# Altium schematic sheet PT1000_interface.SchDoc: RTD analog interface
size A3; Date: 30.05.2015; Author: Michał Gumiela; DocumentNumber: 5; SheetNumber: 5; SheetTotal: 9; Model: EM1; PageSetup: Record=PageOptions|CenterHorizontal=True|CenterVertical=True|PrintScale=0.52|XCorrection=1.00|YCorrection=1.00|PrintKind=1|BorderSize=5000000|LeftOffset=0|BottomOffset=0|Orientation=2|PaperLength=4200|PaperWidth=2970|Scale=100|PaperSource=7|PrintQuality=600|MediaType=1|DitherType=10|PaperKind=A3|PrintScaleMode=1
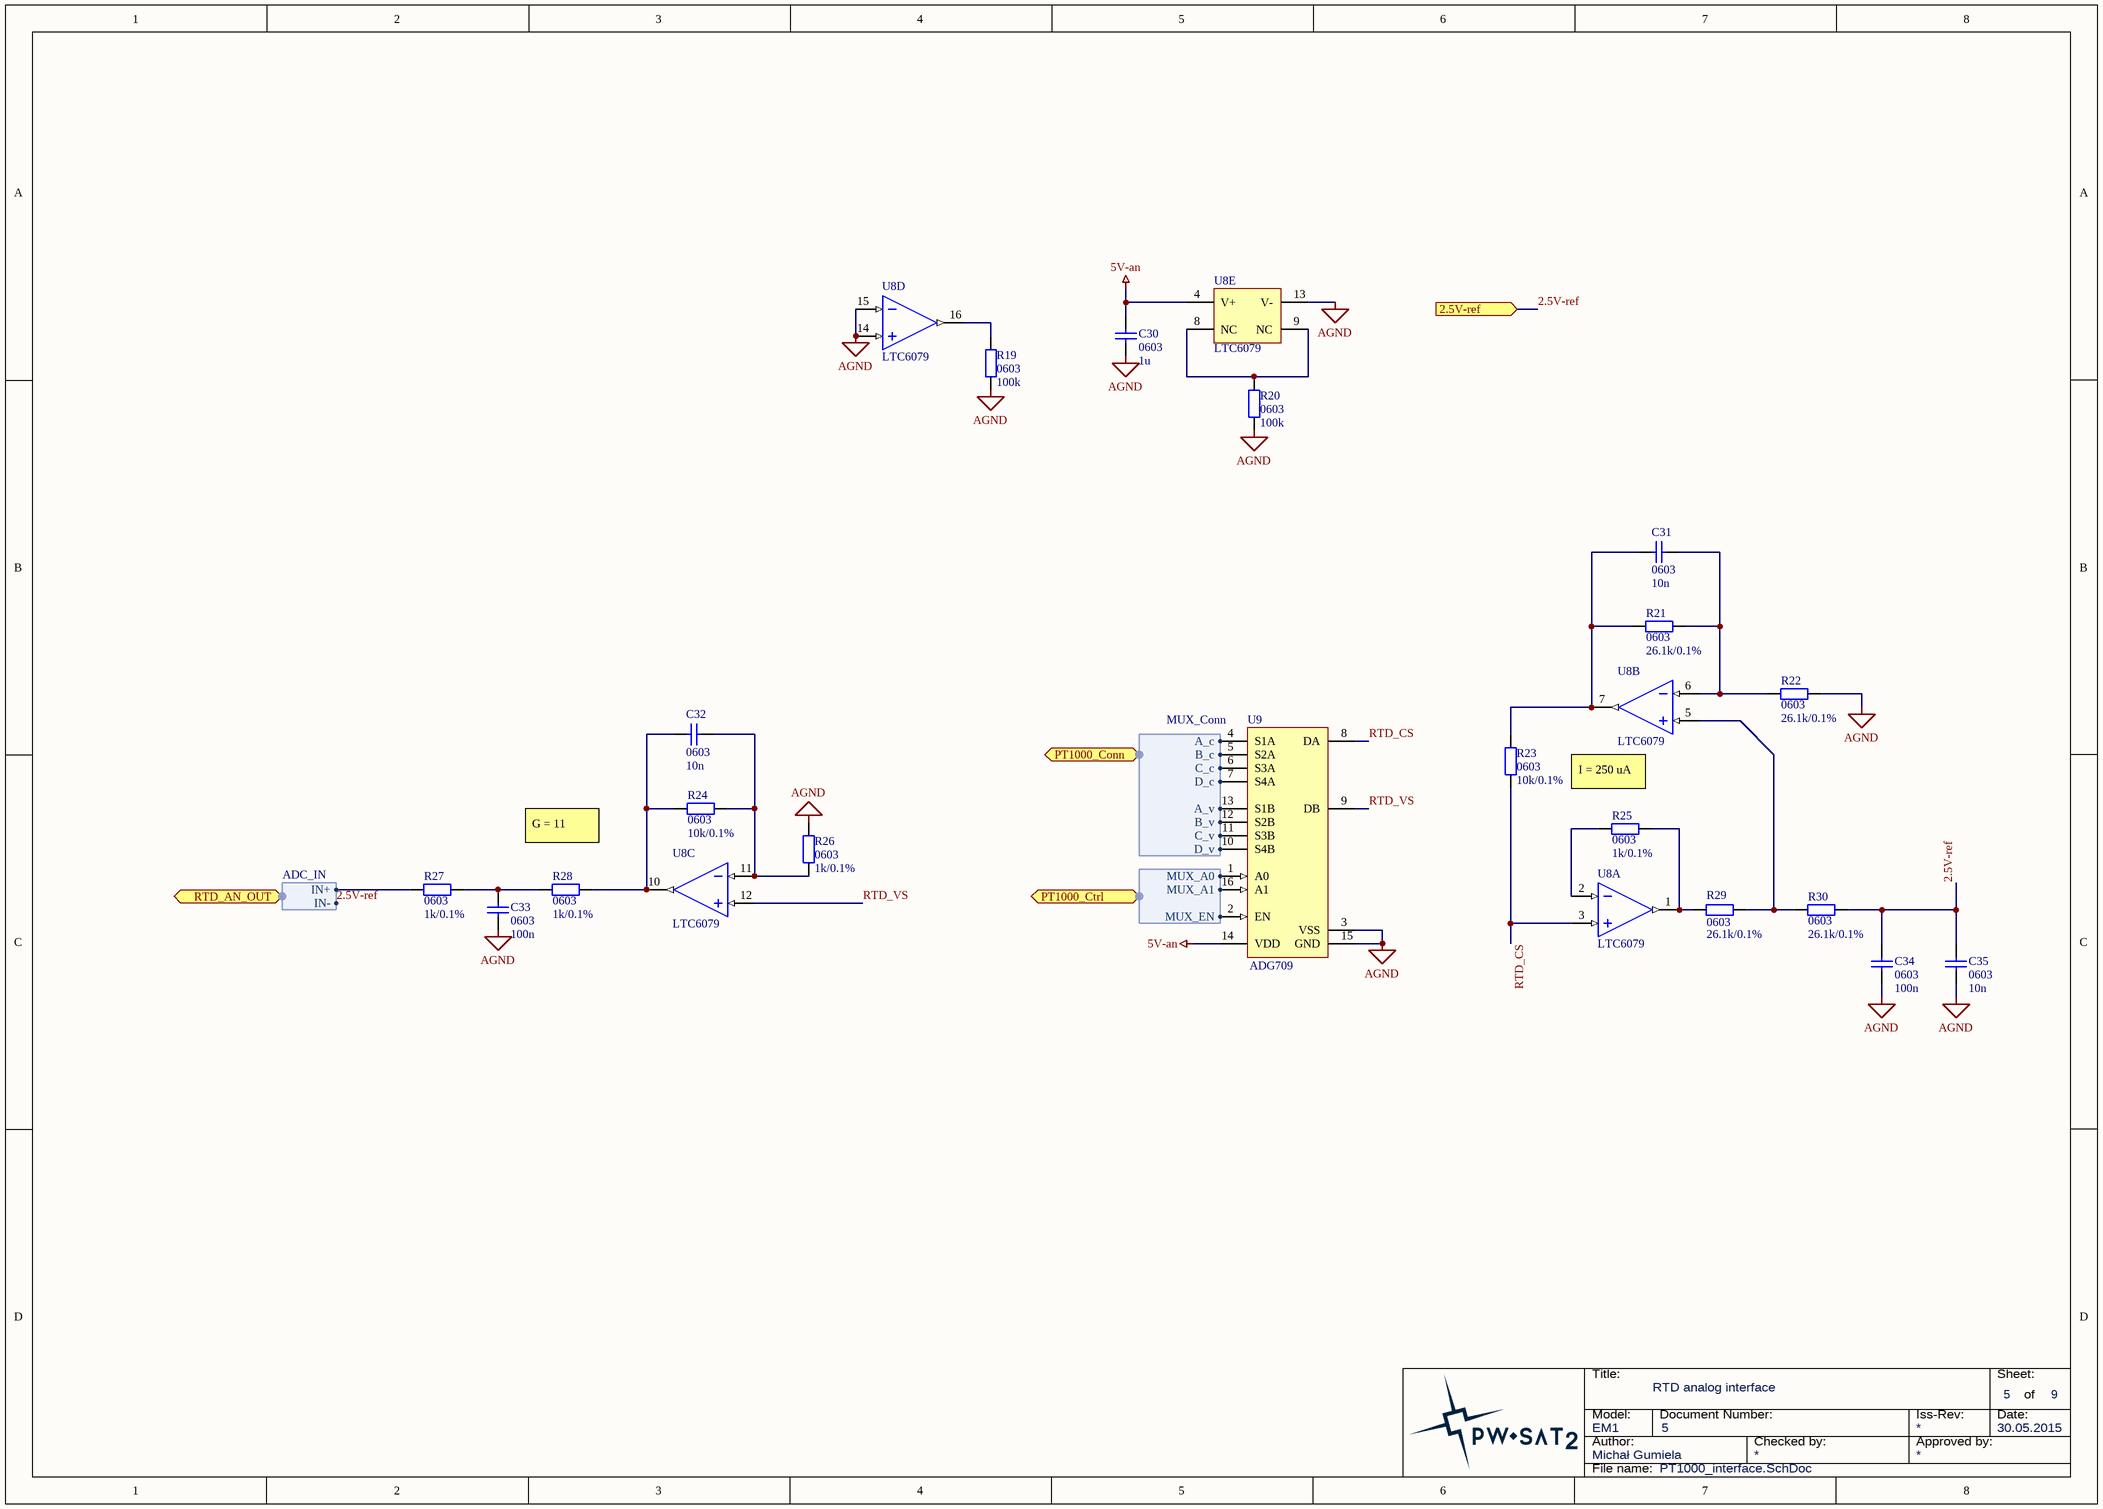
[diagram p0: PT1000_interface.SchDoc]

## Parts
C30  0603  value 1u  [SMD_Capacitor_0603]
C31  0603  value 10n  [SMD_Capacitor_0603]
C32  0603  value 10n  [SMD_Capacitor_0603]
C33  0603  value 100n  [SMD_Capacitor_0603]
C34  0603  value 100n  [SMD_Capacitor_0603]
C35  0603  value 10n  [SMD_Capacitor_0603]
R19  0603  value 100k  [SMD_Resistor_0603]
R20  0603  value 100k  [SMD_Resistor_0603]
R21  0603  value 26.1k/0.1%  [SMD_Resistor_0603]
R22  0603  value 26.1k/0.1%  [SMD_Resistor_0603]
R23  0603  value 10k/0.1%  [SMD_Resistor_0603]
R24  0603  value 10k/0.1%  [SMD_Resistor_0603]
R25  0603  value 1k/0.1%  [SMD_Resistor_0603]
R26  0603  value 1k/0.1%  [SMD_Resistor_0603]
R27  0603  value 1k/0.1%  [SMD_Resistor_0603]
R28  0603  value 1k/0.1%  [SMD_Resistor_0603]
R29  0603  value 26.1k/0.1%  [SMD_Resistor_0603]
R30  0603  value 26.1k/0.1%  [SMD_Resistor_0603]
U8  LTC6079  [SSOP-16]  (parts A,B,C,D,E of 5)
U9  ADG709  [TSSOP16]

## Ports
2.5V-ref (in), PT1000_Conn (harness MUX_Conn), PT1000_Ctrl (harness MUX_Ctrl), RTD_AN_OUT (harness ADC_IN)

## Harnesses
MUX_Ctrl: MUX_A0, MUX_A1, MUX_EN
MUX_Conn: A_c, B_c, C_c, D_c, A_v, B_v, C_v, D_v
ADC_IN: IN+, IN-

## Nets
5V-an: C30.2 U8.4(V+) U9.14(VDD)
AGND: C30.1 C33.1 C34.1 C35.1 R19.1 R20.1 R22.1 R26.1 U8.13(V-) U8.14(IN+_D) U8.15(IN-_D) U9.3(VSS) U9.15(GND)
2.5V-ref: C34.2 C35.2 R30.1 ; port 2.5V-ref, port RTD_AN_OUT.IN-
RTD_CS: R23.1 U8.3(IN+_A) U9.8(DA)
RTD_VS: U8.12(IN+_C) U9.9(DB)
NetC31_1: C31.1 R21.1 R22.2 U8.6(IN-_B)
NetC31_2: C31.2 R21.2 R23.2 U8.7(OUT_B)
NetC32_1: C32.1 R24.1 R26.2 U8.11(IN-_C)
NetC32_2: C32.2 R24.2 R28.2 U8.10(OUT_C)
NetC33_2: C33.2 R27.2 R28.1
NetR19_2: R19.2 U8.16(OUT_D)
NetR20_2: R20.2 U8.8(NC) U8.9(NC)
NetR25_1: R25.1 U8.2(IN-_A)
NetR25_2: R25.2 R29.2 U8.1(OUT_A)
NetR27_1: R27.1 ; port RTD_AN_OUT.IN+
NetR29_1: R29.1 R30.2 U8.5(IN+_B)
NetU9_1: U9.1(A0) ; port PT1000_Ctrl.MUX_A0
NetU9_2: U9.2(EN) ; port PT1000_Ctrl.MUX_EN
NetU9_4: U9.4(S1A) ; port PT1000_Conn.A_c
NetU9_5: U9.5(S2A) ; port PT1000_Conn.B_c
NetU9_6: U9.6(S3A) ; port PT1000_Conn.C_c
NetU9_7: U9.7(S4A) ; port PT1000_Conn.D_c
NetU9_10: U9.10(S4B) ; port PT1000_Conn.D_v
NetU9_11: U9.11(S3B) ; port PT1000_Conn.C_v
NetU9_12: U9.12(S2B) ; port PT1000_Conn.B_v
NetU9_13: U9.13(S1B) ; port PT1000_Conn.A_v
NetU9_16: U9.16(A1) ; port PT1000_Ctrl.MUX_A1

## Notes on the sheet
- I = 250 uA
- G = 11
- Title:
- Sheet:
- of
- Author:
- Model:
- Document Number:
- Checked by:
- Iss-Rev:
- Approved by:
- Date:
- File name:

## Library data of the parts
C30-C35 = Cap: Capacitor; Published: 8-Jun-2000; LatestRevisionDate: 17-Jul-2002; LatestRevisionNote: Re-released for DXP Platform.; PackageReference: RAD-0.3; Publisher: Altium Limited; PackageDescription: Radial Cap, Thru-Hole; 2 Leads; 0.3 in Pin Spacing
R19-R30 = Res2: Resistor; Published: 8-Jun-2000; LatestRevisionDate: 17-Jul-2002; LatestRevisionNote: Re-released for DXP Platform.; PackageReference: AXIAL-0.4; Publisher: Altium Limited; PackageDescription: Axial Device, Thru-Hole; 2 Leads; 0.4 in Pin Spacing
U8 = LTC6079: Rail-to-rail, quad operational amplifier. Library compatible with LTC608X LTC607X op-amps; Manufacturer: Linear Technology; Value: LTC6079
U9 = ADG709: CMOS Analog 4-Channel Multiplexer; Manufacturer: Analog Devices; ManufacturerPartNumber: ADG709